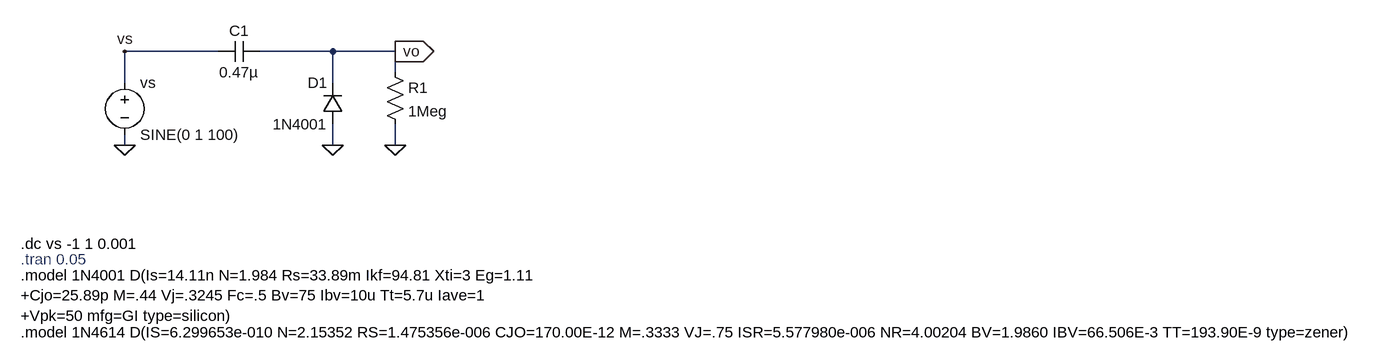
[diagram p0: schematic Lab6p5.asc]
Lab6p5.asc, the LTspice schematic file:
Version 4
SHEET 1 2280 680
WIRE 304 16 160 16
WIRE 480 16 368 16
WIRE 576 16 480 16
WIRE 576 48 576 16
WIRE 160 64 160 16
WIRE 480 64 480 16
WIRE 160 160 160 144
WIRE 480 160 480 128
WIRE 576 160 576 128
FLAG 160 160 0
FLAG 576 16 vo
IOPIN 576 16 Out
FLAG 160 16 vs
FLAG 576 160 0
FLAG 480 160 0
SYMBOL voltage 160 48 R0
WINDOW 123 0 0 Left 0
WINDOW 39 0 0 Left 0
SYMATTR InstName vs
SYMATTR Value SINE(0 1 100)
SYMBOL res 560 32 R0
SYMATTR InstName R1
SYMATTR Value 1Meg
SYMBOL cap 368 0 R90
WINDOW 0 0 32 VBottom 2
WINDOW 3 32 32 VTop 2
SYMATTR InstName C1
SYMATTR Value 0.47µ
SYMBOL diode 496 128 R180
WINDOW 0 24 64 Left 2
WINDOW 3 24 0 Left 2
SYMATTR InstName D1
SYMATTR Value 1N4001
TEXT 0 360 Left 2 !.model 1N4001 D(Is=14.11n N=1.984 Rs=33.89m Ikf=94.81 Xti=3 Eg=1.11\n+Cjo=25.89p M=.44 Vj=.3245 Fc=.5 Bv=75 Ibv=10u Tt=5.7u Iave=1\n+Vpk=50 mfg=GI type=silicon)
TEXT 0 336 Left 2 ;.tran 0.05
TEXT 0 312 Left 2 !.dc vs -1 1 0.001
TEXT 0 448 Left 2 !.model 1N4614 D(IS=6.299653e-010 N=2.15352 RS=1.475356e-006 CJO=170.00E-12 M=.3333 VJ=.75 ISR=5.577980e-006 NR=4.00204 BV=1.9860 IBV=66.506E-3 TT=193.90E-9 type=zener)

The netlist it stands for:
* Lab6p5.asc
vs vs 0 SINE(0 1 100)
R1 vo 0 1Meg
C1 vo vs 0.47µ
D1 0 vo 1N4001
.model D D
.lib standard.dio
.model 1N4001 D(Is=14.11n N=1.984 Rs=33.89m Ikf=94.81 Xti=3 Eg=1.11
+Cjo=25.89p M=.44 Vj=.3245 Fc=.5 Bv=75 Ibv=10u Tt=5.7u Iave=1
+Vpk=50 mfg=GI type=silicon)
* .tran 0.05
.dc vs -1 1 0.001
.model 1N4614 D(IS=6.299653e-010 N=2.15352 RS=1.475356e-006 CJO=170.00E-12 M=.3333 VJ=.75 ISR=5.577980e-006 NR=4.00204 BV=1.9860 IBV=66.506E-3 TT=193.90E-9 type=zener)
.backanno
.end